# EAGLE design aprs-wx (EAGLE 7.2.0)
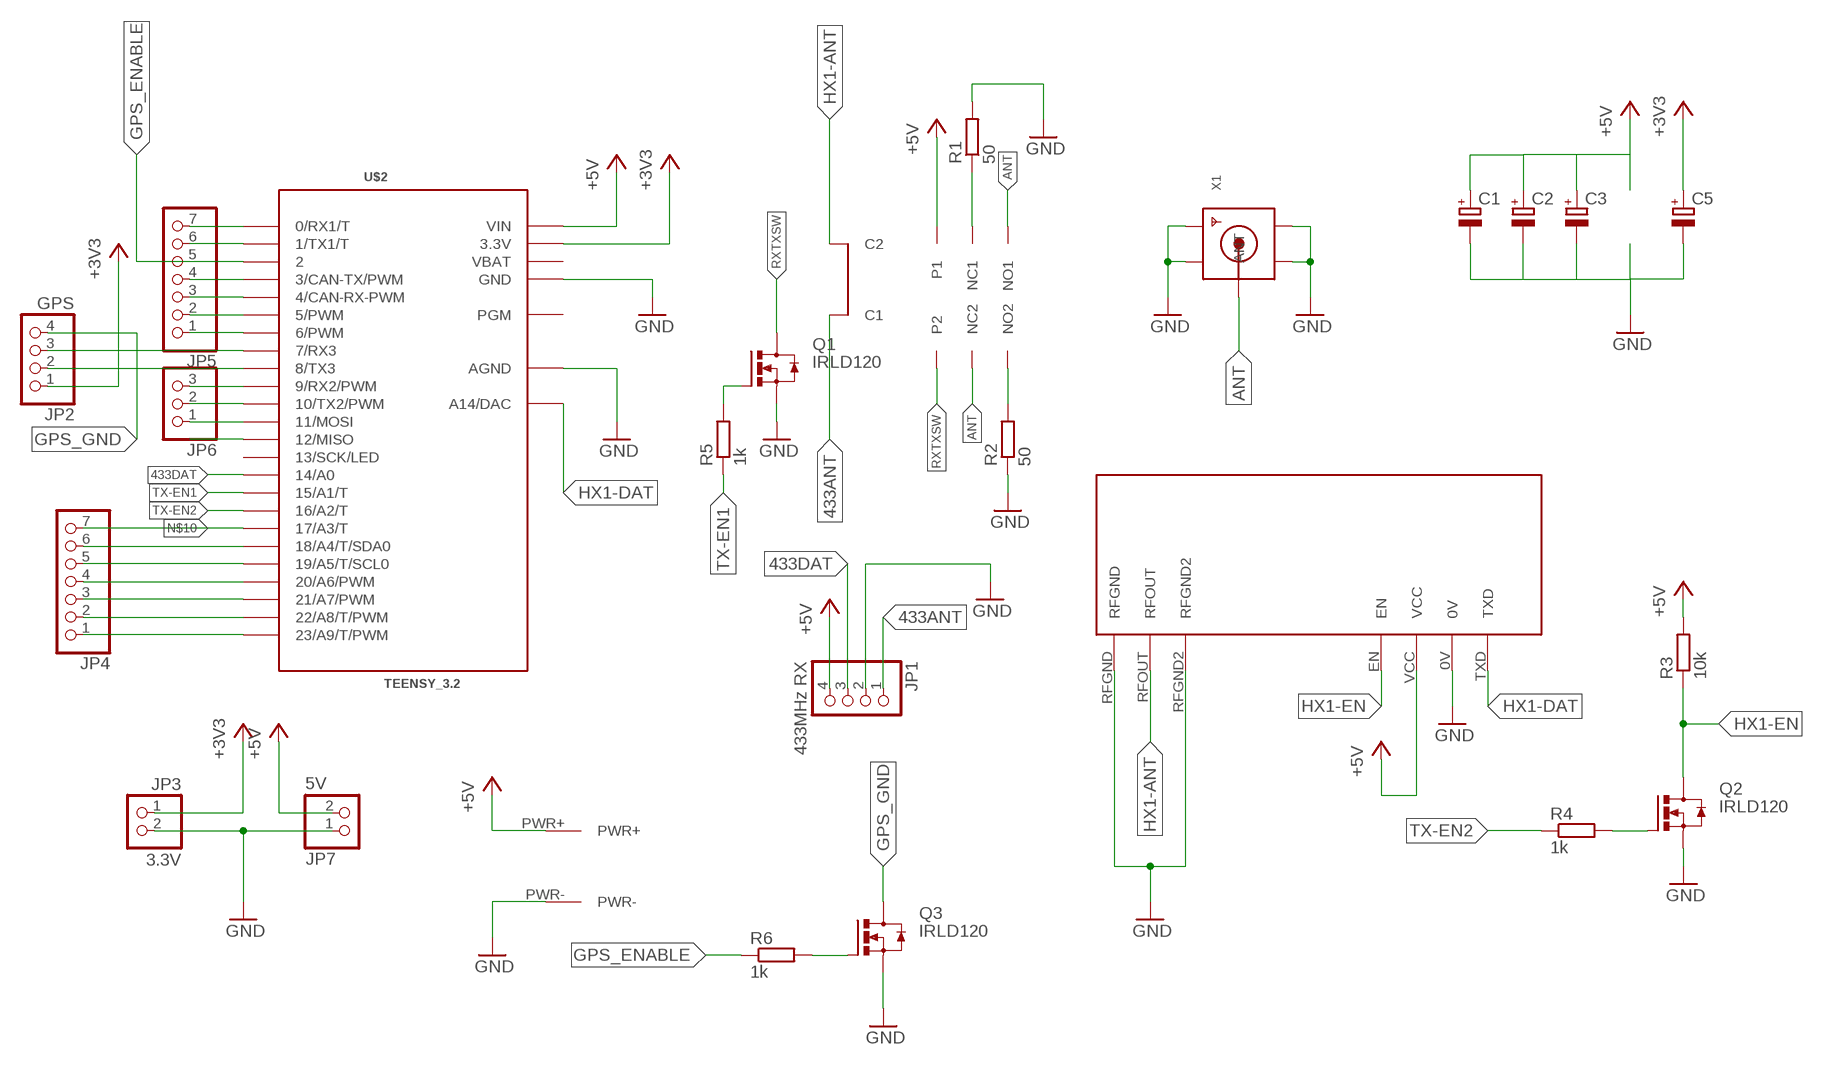
[diagram p0: schematic, sheet 1]

## Parts
BTPL1  GS-SH-2XXT5V  [GOODSKY_RELAY]
C1  CPOL-EUE2,5-6E  [E2,5-6E]
C2  CPOL-EUE2,5-6E  [E2,5-6E]
C3  CPOL-EUE2,5-6E  [E2,5-6E]
C5  CPOL-EUE2,5-6E  [E2,5-6E]
JP1  433MHz RX  PINHD-1X4  [1X04]
JP2  GPS  PINHD-1X4  [1X04]
JP3  3.3V  PINHD-1X2  [1X02]
JP4  PINHD-1X7  [1X07]
JP5  PINHD-1X7  [1X07]
JP6  PINHD-1X3  [1X03]
JP7  5V  PINHD-1X2  [1X02]
Q1  IRLD120  [HVMDIP]
Q2  IRLD120  [HVMDIP]
Q3  IRLD120  [HVMDIP]
R1  50  R-EU_0207/10  [0207/10]
R2  50  R-EU_0207/10  [0207/10]
R3  10k  R-EU_0207/10  [0207/10]
R4  1k  R-EU_0207/10  [0207/10]
R5  1k  R-EU_0207/10  [0207/10]
R6  1k  R-EU_0207/10  [0207/10]
U$1  RADIOMETRIX-HX1  [RADIOMETRIX-HX1]
U$2  TEENSY_3.2  TEENSY_3.1-3.2_OUTER_ROW  [TEENSY_3.0-3.2&LC_OUTER_ROW]
U$3  SOLDERPWR-1  [SOLDERPWR-1]
X1  SMACONNECTOR_EDGE  [SMA_EDGELAUNCH]

## Nets
433ANT: BTPL1.P2(C1) JP1.1
433DAT: JP1.3 U$2.14/A0
+3V3: C5.+ JP2.1 JP3.1 U$2.3.3V U$2.3.3V1(3.3V)
+5V: BTPL1.C2(P1) C1.+ C2.+ C3.+ JP1.4 JP7.2 R3.2 U$1.VCC U$2.VIN U$3.PWR+
ANT: BTPL1.NC2(NO1) BTPL1.NO1(NC2) X1.P(ANT)
GND: C1.- C2.- C3.- C5.- JP1.2 JP3.2 JP7.1 Q1.S Q2.S Q3.S R1.2 R2.1 U$1.0V U$1.RFGND U$1.RFGND2 U$2.AGND U$2.GND U$2.GND1(GND) U$3.PWR- X1.GND@1(GND4) X1.GND@2(GND3) X1.GND@3(GND2) X1.GND@4(GND1)
GPS_ENABLE: JP5.5 R6.1 U$2.2
GPS_GND: JP2.4 Q3.D@1(D) Q3.D@2(D)
HX1-ANT: BTPL1.P1(C2) U$1.RFOUT
HX1-DAT: U$1.TXD U$2.RESET/DAC(A14/DAC)
HX1-EN: Q2.D@1(D) Q2.D@2(D) R3.1 U$1.EN
N$1: BTPL1.NO2(NC1) R1.1
N$2: Q2.G R4.2
N$3: Q1.G R5.2
N$5: BTPL1.NC1(NO2) R2.2
N$6: JP2.2 U$2.8(8/TX3)
N$7: JP2.3 U$2.7(7/RX3)
N$8: JP4.1 U$2.23/A9(23/A9/T/PWM)
N$9: JP4.2 U$2.22/A8(22/A8/T/PWM)
N$10: JP4.7 U$2.17/A3(17/A3/T)
N$11: JP4.3 U$2.21/A7(21/A7/PWM)
N$12: JP4.4 U$2.20/A6(20/A6/PWM)
N$13: JP4.5 U$2.19/A5(19/A5/T/SCL0)
N$14: JP4.6 U$2.18/A4(18/A4/T/SDA0)
N$15: JP5.7 U$2.0(0/RX1/T)
N$16: JP5.6 U$2.1(1/TX1/T)
N$17: JP5.4 U$2.3(3/CAN-TX/PWM)
N$18: JP5.3 U$2.4(4/CAN-RX-PWM)
N$19: JP5.2 U$2.5(5/PWM)
N$20: JP5.1 U$2.6(6/PWM)
N$21: JP6.3 U$2.9(9/RX2/PWM)
N$22: JP6.2 U$2.10(10/TX2/PWM)
N$23: JP6.1 U$2.11(11/MOSI)
N$24: U$2.12(12/MISO)
N$25: Q3.G R6.2
RXTXSW: BTPL1.C1(P2) Q1.D@1(D) Q1.D@2(D)
TX-EN1: R5.1 U$2.15/A1(15/A1/T)
TX-EN2: R4.1 U$2.16/A2(16/A2/T)
Unconnected: U$2.13(13/SCK/LED) U$2.PGM

## Power pins joined to a net without a drawn wire
VBAT: U$2.VBAT

## Library data of the parts
BTPL1 = goodsky_btpl:GS-SH-2XXT: goodsky plastic shielded relay
C1-C3 C5 = rcl:CPOL-EU: POLARIZED CAPACITOR, European symbol
JP1 JP2 = pinhead:PINHD-1X4: PIN HEADER
JP3 JP7 = pinhead:PINHD-1X2: PIN HEADER
JP4 JP5 = pinhead:PINHD-1X7: PIN HEADER
JP6 = pinhead:PINHD-1X3: PIN HEADER
Q1-Q3 = transistor-power:IRLD120: N-Channel Power MOSFET
R1-R6 = rcl:R-EU_: RESISTOR, European symbol
U$1 = Ava:RADIOMETRIX-HX1
U$2 = Teensy_3_and_LC_Series_Boards_v1.4:TEENSY_3.1-3.2_OUTER_ROW: Footprint for Teensy 3.1 or 3.2 board using all pin connections on the outer perimeter
U$3 = MyLibs:SOLDERPWR-1
X1 = adafruit:SMACONNECTOR: SMA Connector 90° DIP SMA Connector, 50 Ohm (4UConnector: 07259)

## Board
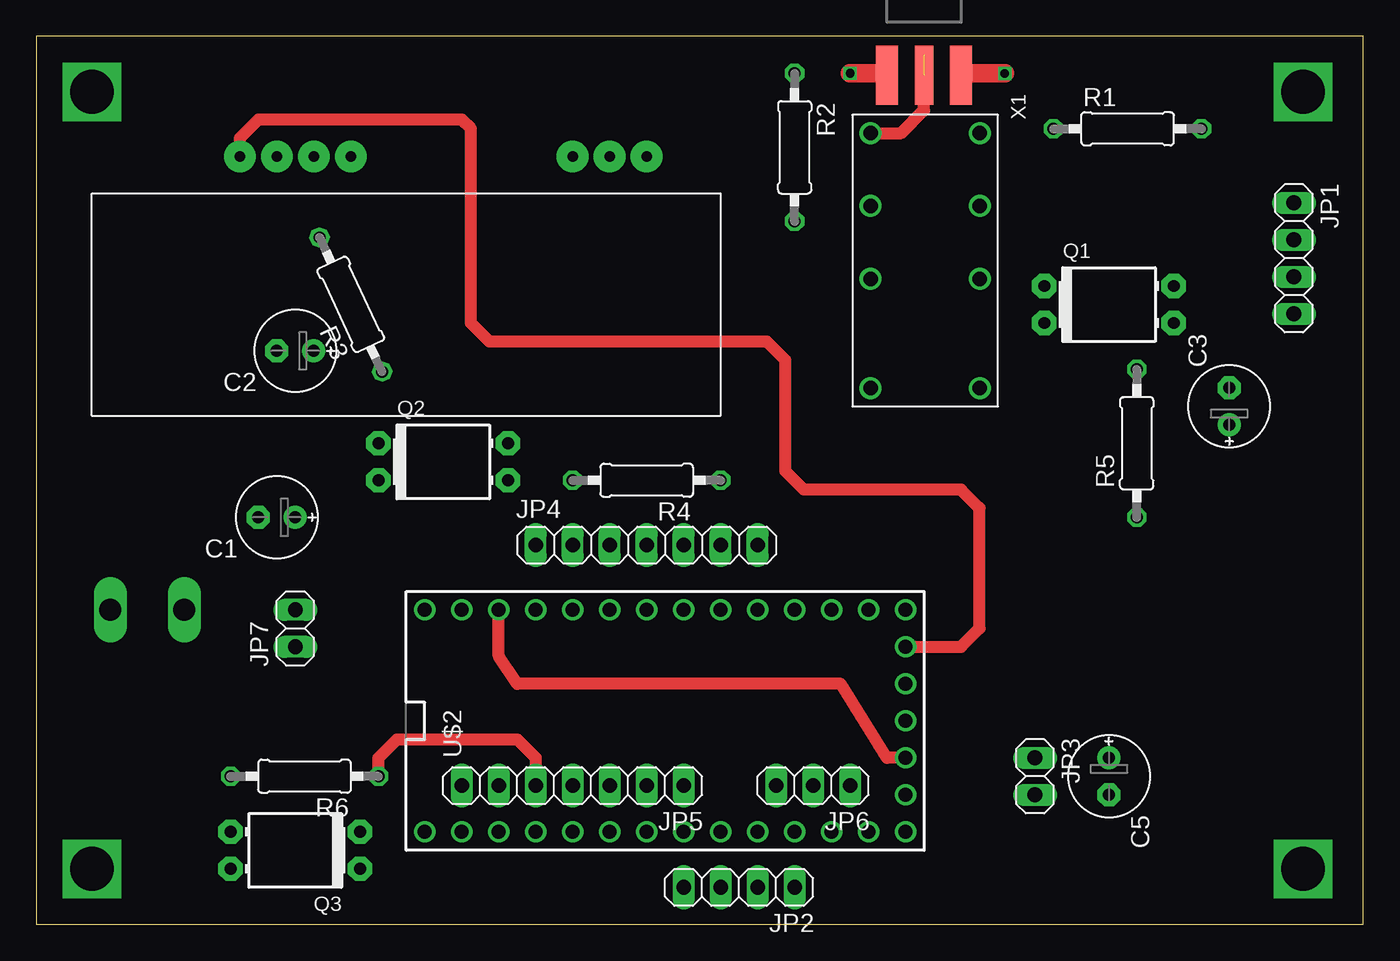
[diagram p1: board, top side]
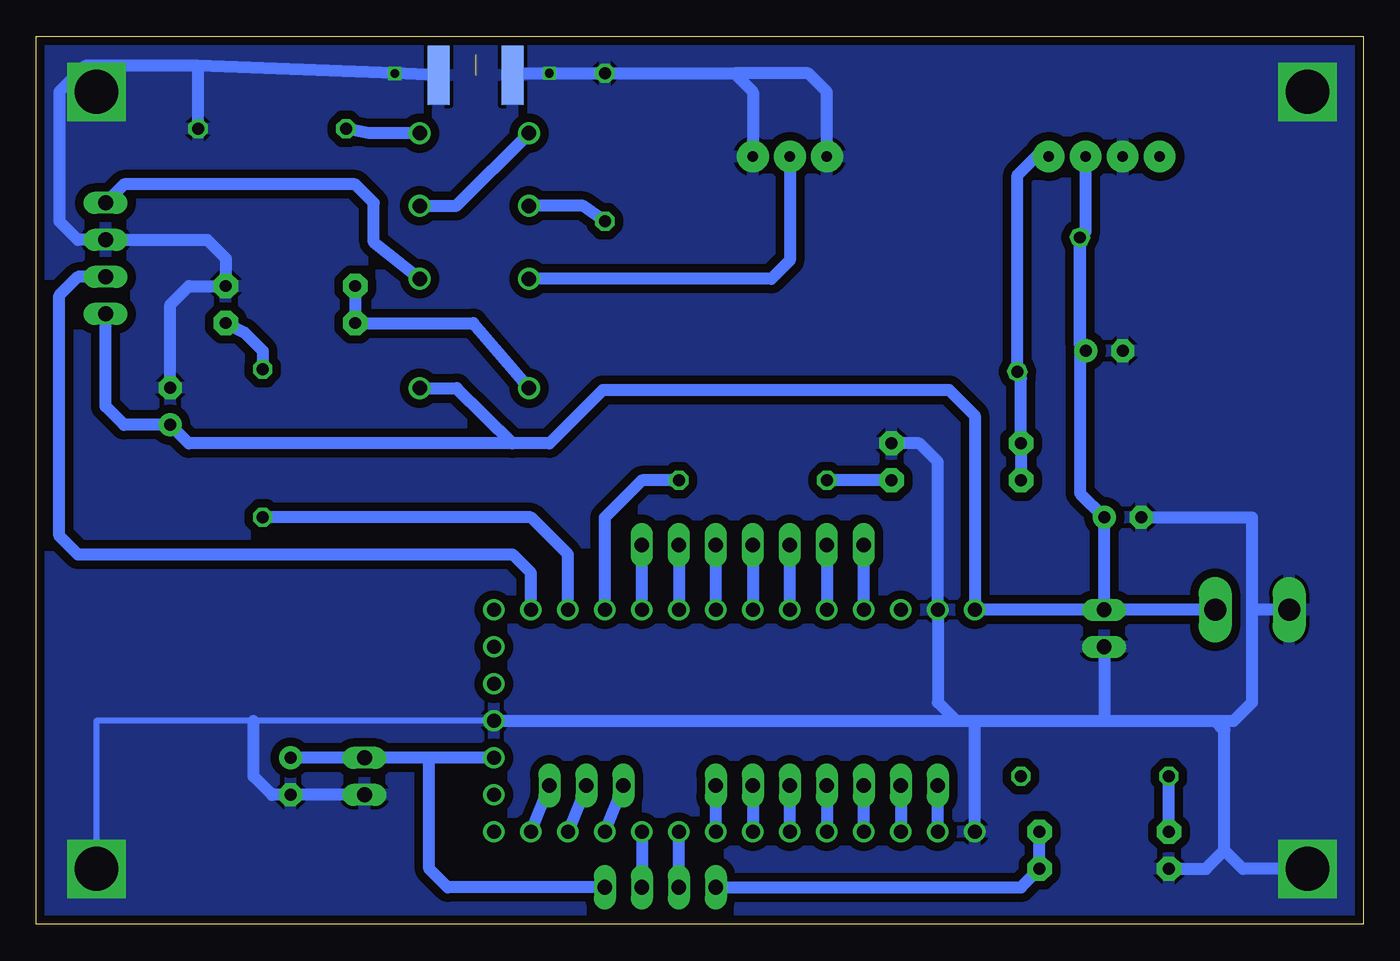
[diagram p2: board, bottom side, seen from below]

Size 91.11 x 60.95 mm. Coordinates in mm from the lower left corner, seen from the top.
Outline: 0,0 91.11,0 91.11,60.95 0,60.95 0,0
Copper layers (1*16): Top 0.035mm / dielectric 1.5mm / Bottom 0.035mm
Design rules "SeeedStudio_2layer_DRU_no_angle_20140221": minimum track width 6mil, minimum drill 12mil, track to track 6mil, track to pad 6mil, pad to pad 6mil, via to via 6mil, smd to smd 0mil, copper to edge 10mil, drill to drill 10mil, minimum pad ring 10mil, minimum via ring 6mil, stop-mask expansion 2mil, vias tented up to drill 100mil, thermal gap 10mil

### Footprints (pad centres in the part's own frame; a part is rotated, then mirrored left to right if it is on the bottom)
GOODSKY_RELAY = drill 1: C1 1.25,8.75; C2 1.25,1.25; NC1 13.75,8.75; NC2 13.75,1.25; NO1 18.75,8.75; NO2 18.75,1.25; P1 8.75,8.75; P2 8.75,1.25
E2,5-6E = drill 0.813 pad 1.575: + -1.27,0 | drill 0.813 pad 1.575 octagon: - 1.27,0
1X04 = drill 1.016 long: 1 -3.81,0; 2 -1.27,0; 3 1.27,0; 4 3.81,0
1X02 = drill 1.016 long: 1 -1.27,0; 2 1.27,0
1X07 = drill 1.016 long: 1 -7.62,0; 2 -5.08,0; 3 -2.54,0; 4 0,0; 5 2.54,0; 6 5.08,0; 7 7.62,0
1X03 = drill 1.016 long: 1 -2.54,0; 2 0,0; 3 2.54,0
HVMDIP = drill 0.813 pad 1.676 octagon: D@1 -4.445,1.27; D@2 -4.445,-1.27; G 4.448,-1.27; S 4.448,1.27
0207/10 = drill 0.813 octagon: 1 -5.08,0; 2 5.08,0
RADIOMETRIX-HX1 = drill 0.7 pad 2.184: 0V 8.89,-10.16; EN 3.81,-10.16; RFGND -11.43,-10.16; RFGND2 -16.51,-10.16; RFOUT -13.97,-10.16; TXD 11.43,-10.16; VCC 6.35,-10.16
TEENSY_3.0-3.2&LC_OUTER_ROW = drill 0.965: 0 -7.62,13.97; 1 -7.62,11.43; 2 -7.62,8.89; 3 -7.62,6.35; 3.3V 7.62,11.43; 3.3V1 -2.54,-16.51; 4 -7.62,3.81; 5 -7.62,1.27; 6 -7.62,-1.27; 7 -7.62,-3.81; 8 -7.62,-6.35; 9 -7.62,-8.89; 10 -7.62,-11.43; 11 -7.62,-13.97; 12 -7.62,-16.51; 13 7.62,-16.51; 14/A0 7.62,-13.97; 15/A1 7.62,-11.43; 16/A2 7.62,-8.89; 17/A3 7.62,-6.35; 18/A4 7.62,-3.81; 19/A5 7.62,-1.27; 20/A6 7.62,1.27; 21/A7 7.62,3.81; 22/A8 7.62,6.35; 23/A9 7.62,8.89; AGND 7.62,13.97; GND -7.62,16.51; GND1 0,-16.51; PGM 2.54,-16.51; RESET/DAC 5.08,-16.51; VBAT -5.08,-16.51; VIN 7.62,16.51
SOLDERPWR-1 = drill 1.5 long: PWR+ 0,2.54; PWR- 0,-2.54
SMA_EDGELAUNCH = smd 4.064 x 1.524: GND@1 2.032,-2.54; GND@2 2.032,2.54 | smd 4.064 x 1.524 bottom: GND@3 2.032,2.54; GND@4 2.032,-2.54 | smd 4.064 x 1.27: P 2.032,0

### Placement (x,y rotation side)
BTPL1  66.04,35.56 90 top
C1  16.51,27.94 180 top
C2  17.78,39.37 180 top
C3  81.92,35.56 90 top
C5  73.66,10.16 270 top
JP1  86.36,45.72 270 top
JP2  48.26,2.54 180 top
JP3  68.58,10.16 270 top
JP4  41.91,26.04 0 top
JP5  36.83,9.53 180 top
JP6  53.34,9.53 180 top
JP7  17.78,20.32 90 top
Q1  73.66,42.55 0 top
Q2  27.94,31.75 0 top
Q3  17.78,5.08 180 top
R1  74.93,54.61 0 top
R2  52.07,53.34 270 top
R3  21.59,42.55 115 top
R4  41.91,30.48 180 top
R5  75.56,33.02 90 top
R6  18.41,10.16 180 top
U$1  25.4,42.55 180 top
U$2  43.18,13.97 90 top
U$3  7.62,21.59 270 top
X1  60.96,60.33 270 top

### Tracks (layer width: path | path; a pad name or v marks a point on that pad's centre or on a via)
433ANT
  Bottom 0.813: JP1.1 85.09,50.8 69.22,50.8 67.94,49.53 67.94,46.83 BTPL1.P2
433DAT
  Bottom 0.813: U$2.14/A0 57.15,24.13 58.42,25.4 88.27,25.4 89.53,26.67 89.53,43.18 88.27,44.45 JP1.3
+3V3
  Top 0.813: U$2.3.3V 31.75,18.41 33.02,16.51 55.24,16.51 58.42,11.43 U$2.3.3V1
  Bottom 0.813: U$2.3.3V1 64.14,11.43 | 64.14,11.43 JP3.1 C5.+ | JP2.1 62.87,2.54 64.14,3.81 64.14,11.43
+5V
  Bottom 0.813: 58.42,33.02 55.88,33.02 52.21,36.69 28.43,36.69 26.67,34.92 U$2.VIN JP7.2 | BTPL1.C2 62.25,36.81 58.42,33.02 | U$3.PWR+ JP7.2 | JP7.2 C1.+ 19.44,29.6 R3.2 | 58.42,33.02 80.64,33.02 C3.+ 85.09,34.29 86.36,35.56 JP1.4 | R3.2 19.05,47.54 U$1.VCC | C2.+ 19.44,39.76 R3.2
ANT  (1 unrouted)
  Top 0.813: BTPL1.NO1 59.39,54.31 60.96,55.88 60.96,59.69
  Bottom 0.813: BTPL1.NC2 62.29,49.31 BTPL1.NO1
GND  (via drill 0.6, 3)
  Top 1.27: v55.88,58.42 58.29,58.42 X1.GND@1 | v66.5,58.41 63.62,58.41 X1.GND@2
  Bottom 0.406: U$2.GND1 76.2,13.97 87,13.97 v87,3.81
  Bottom 0.813: X1.GND@1 57.91,58.42 v55.88,58.42 R2.1 43.18,58.42 | 80.01,58.93 87.76,58.93 88.27,58.42 | U$2.GND 26.67,13.97 | U$2.GND1 27.94,13.97 | 27.94,13.97 26.67,13.97 | R1.2 80.01,58.93 | 26.67,13.97 17.78,13.97 | 17.78,13.97 10.16,13.97 | 10.16,13.97 8.89,13.97 7.62,15.24 7.62,21.59 | 7.62,21.59 7.62,27.94 C1.- | Q2.S 30.48,33.02 29.21,31.75 U$2.AGND 29.21,15.24 27.94,13.97 | U$3.PWR- 7.62,21.59 | X1.GND@2 v66.5,58.41 80.01,58.93 | 88.27,58.42 89.53,57.15 89.53,48.26 88.27,46.99 JP1.2 79.38,46.99 78.11,45.72 Q1.S 80.64,43.81 81.92,42.55 C3.- | JP3.2 74.93,8.89 76.2,10.16 76.2,13.97 | v3.81,3.81 8.26,3.81 9.53,5.08 | 9.53,5.08 9.53,13.34 10.16,13.97 | v87,57.15 88.27,58.42 | JP7.1 17.78,13.97 | 43.18,58.42 41.91,57.15 U$1.RFGND2 | U$1.RFGND 36.83,57.15 38.1,58.42 43.18,58.42 | Q3.S 10.79,3.81 9.53,5.08
  other vias: 3.81,57.15
  pour Bottom (isolate 0.584): 0,60.96 90.17,60.96 91.44,59.69 91.44,0 1.27,0 0,1.27
GPS_ENABLE
  Top 0.813: R6.1 23.5,11.43 24.77,12.7 33.02,12.7 34.29,11.43 JP5.5
  Bottom 0.813: U$2.2 JP5.5
GPS_GND
  Bottom 0.813: JP2.4 23.5,2.54 Q3.D@1 Q3.D@2
HX1-ANT
  Bottom 0.813: U$1.RFOUT 39.37,45.58 40.64,44.31 BTPL1.P1
HX1-DAT
  Top 0.813: U$2.RESET/DAC 63.5,19.05 64.77,20.32 64.77,28.57 63.5,29.84 52.7,29.84 51.44,31.11 51.44,38.73 50.16,40.01 31.11,40.01 29.84,41.27 29.84,54.61 29.21,55.24 15.24,55.24 13.97,53.98 U$1.TXD
HX1-EN
  Bottom 0.813: Q2.D@2 Q2.D@1 23.5,37.47 R3.1 23.74,51.44 22.47,52.7 U$1.EN
N$1
  Bottom 0.813: BTPL1.NO2 68.28,54.31 R1.1
N$2
  Bottom 0.813: Q2.G R4.2
N$3
  Bottom 0.813: Q1.G 76.83,40.64 75.56,39.37 R5.2
N$5
  Bottom 0.813: R2.2 53.56,49.31 BTPL1.NC1
N$6
  Bottom 0.813: U$2.8 JP2.2
N$7
  Bottom 0.813: JP2.3 U$2.7
N$8
  Bottom 0.813: U$2.23/A9 JP4.1
N$9
  Bottom 0.813: JP4.2 U$2.22/A8
N$10
  Bottom 0.813: U$2.17/A3 JP4.7
N$11
  Bottom 0.813: U$2.21/A7 JP4.3
N$12
  Bottom 0.813: JP4.4 U$2.20/A6
N$13
  Bottom 0.813: U$2.19/A5 JP4.5
N$14
  Bottom 0.813: JP4.6 U$2.18/A4
N$15
  Bottom 0.813: U$2.0 JP5.7
N$16
  Bottom 0.813: JP5.6 U$2.1
N$17
  Bottom 0.813: JP5.4 U$2.3
N$18
  Bottom 0.813: U$2.4 JP5.3
N$19
  Bottom 0.813: JP5.2 U$2.5
N$20
  Bottom 0.813: U$2.6 JP5.1
N$21
  Bottom 0.813: U$2.9 JP6.3
N$22
  Bottom 0.813: JP6.2 U$2.10
N$23
  Bottom 0.813: U$2.11 JP6.1
N$25
  Bottom 0.813: Q3.G R6.2
RXTXSW
  Bottom 0.813: Q1.D@1 Q1.D@2 61.12,41.27 BTPL1.C1
TX-EN1
  Bottom 0.813: U$2.15/A1 54.61,25.4 57.15,27.94 R5.1
TX-EN2
  Bottom 0.813: U$2.16/A2 52.07,27.94 49.53,30.48 R4.1

### Text on the board
tValues: ANT | DAT / GND / VCC / TXE | GND / ANT / GND | HX1 | ANT / GND / DAT / VCC | gs-sh.205t | 5V DC | SA2BRJ APRS-WX v1.0 | GND | VCC